# Altium schematic sheet Drive.SchDoc
size A4; SheetNumber: 2; SheetTotal: 6
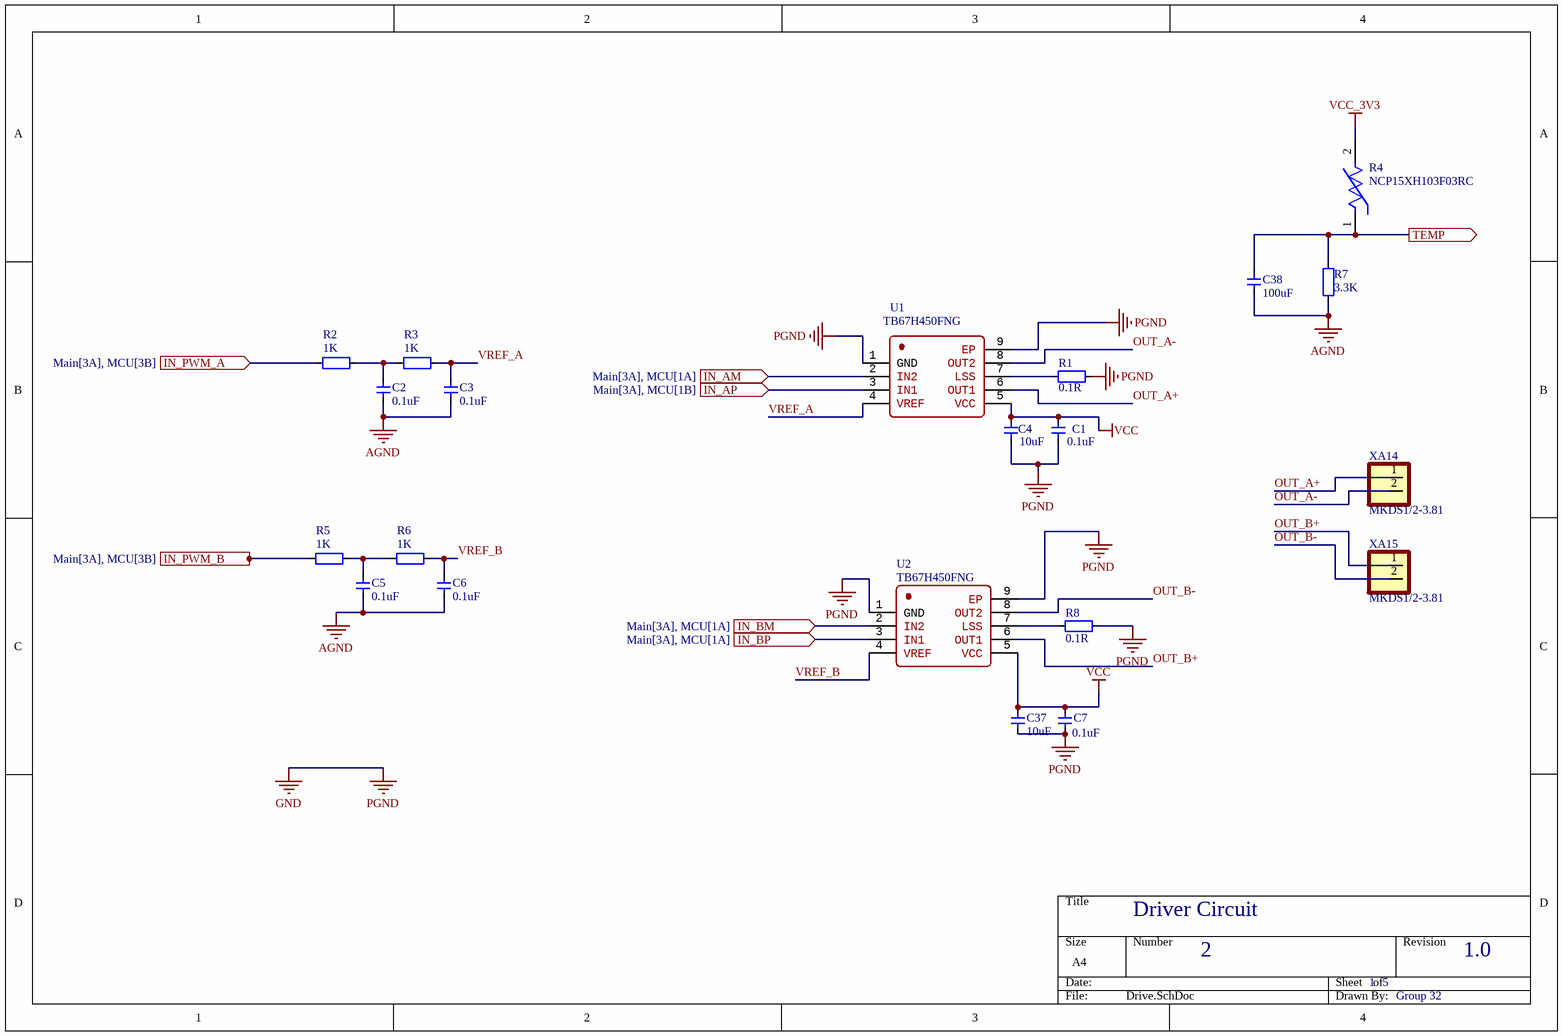
[diagram p0: Drive.SchDoc]

## Parts
C1  0.1uF  [CAPC2013X94X50LL20T25]
C2  0.1uF  [CAPC2013X94X50LL20T25]
C3  0.1uF  [CAPC2013X94X50LL20T25]
C4  10uF  [CAPC2013X94X50LL20T25]
C5  0.1uF  [CAPC2013X94X50LL20T25]
C6  0.1uF  [CAPC2013X94X50LL20T25]
C7  0.1uF  [CAPC2013X94X50LL20T25]
C37  10uF  [CAPC2013X94X50LL20T25]
C38  100uF  [CAPC3216X190N]
R1  0.1R  [RESC3116X65N]
R2  1K  [RESC3116X65N]
R3  1K  [RESC3116X65N]
R4  NCP15XH103F03RC  [FP-NCP15-NCU15-0_05-IPC_C]
R5  1K  [RESC3116X65N]
R6  1K  [RESC3116X65N]
R7  3.3K  [RESC2013X60X35NL10T20]
R8  0.1R  [RESC3116X65N]
U1  TB67H450FNG  [SOIC127P599X175-9N]
U2  TB67H450FNG  [SOIC127P599X175-9N]
XA14  MKDS1/2-3.81  [PHOENIX_MKDS1/2-3.81 - duplicate]
XA15  MKDS1/2-3.81  [PHOENIX_MKDS1/2-3.81 - duplicate]

## Ports
IN_AM (in, see Main[3A], MCU[1A]), IN_AP (in, see Main[3A], MCU[1B]), IN_BM (in, see Main[3A], MCU[1A]), IN_BP (in, see Main[3A], MCU[1A]), IN_PWM_A (in, see Main[3A], MCU[3B]), IN_PWM_B (in, see Main[3A], MCU[3B]), TEMP (out, see Main[3A], MCU[1A])

## Nets
AGND: C2.1 C3.1 C5.1 C6.1 C38.1 R7.1
GND: C1.1 C4.1 C7.1 C37.1 R1.2 R8.2 U1.1(GND) U1.9(EP) U2.1(GND) U2.9(EP)  [also labelled PGND]
VCC: C1.2 C4.2 C7.2 C37.2 U1.5(VCC) U2.5(VCC)
VCC_3V3: R4.2
IN_AM: U1.2(IN2) ; port IN_AM
IN_AP: U1.3(IN1) ; port IN_AP
IN_BM: U2.2(IN2) ; port IN_BM
IN_BP: U2.3(IN1) ; port IN_BP
IN_PWM_A: R2.1 ; port IN_PWM_A
IN_PWM_B: R5.1 ; port IN_PWM_B
OUT_A+: U1.6(OUT1) XA14.1
OUT_A-: U1.8(OUT2) XA14.2
OUT_B+: U2.6(OUT1) XA15.1
OUT_B-: U2.8(OUT2) XA15.2
TEMP: C38.2 R4.1 R7.2 ; port TEMP
VREF_A: C3.2 R3.2 U1.4(VREF)
VREF_B: C6.2 R6.2 U2.4(VREF)
NetC2_2: C2.2 R2.2 R3.1
NetC5_2: C5.2 R5.2 R6.1
NetR1_1: R1.1 U1.7(LSS)
NetR8_1: R8.1 U2.7(LSS)

## Notes on the sheet
- Driver Circuit
- 2
- 1
- 5
- 1.0
- Group 32

## Library data of the parts
C1-C7 C37 = 电容-0402: Capacitor; Value: 0.1u
C38 = 电容-0402: Capacitor; Value: 100uF
R1 R8 = 电阻-1206: Resistor; Value: 22R
R2 R3 R5-R7 = 电阻-0402: Resistor; Value: 22R
R4 = CMP-06022-000003-3: NTC Thermistor for Temperature Sensor, 0402, 10kΩ, 1%, 0.1mA, 5V; Max Power Dissipation: 100mW; Resistance: 10kR; Current Rating: 310uA; Length: 1mm; Min Operating Temperature: -40°C; Max Operating Temperature: 125°C; Resistance Tolerance: 1%; Lead Free: Lead Free; Radiation Hardening: No; Case Code (Imperial): 0402; Depth: 0.5mm; Tolerance: 1%; Packaging: Tape and Reel; Package Quantity: 10000; Series: NCP; Number of Pins: 2; Power Rating: 100mW; Case/Package: 0402; Case Code (Metric): 1005; Height: 0.5mm; Termination: SMD/SMT; RoHS Compliant: Yes; REACH SVHC: No SVHC; Mount: Surface Mount
U1 U2 = TB67H450FNG: PWM Chopper Type DC Brushed Motor Driver
XA14 XA15 = MKDS1/2-3.81: 2 Position Wire to Board Terminal Block Horizontal with Board 0.150 _3.81mm_ Through Hole; MF: Phoenix Contact; Package: None; Price: None; SnapEDA_Link: https://www.snapeda.com/parts/MKDS%201/%202-3.81/Phoenix%20Contact/view-part/114562/?ref=snap; Availability: Unavailable; Value: *; MP: MKDS 1/ 2-3.81